# Altium schematic sheet [1] PWR.SchDoc: ESP32 KIT
size C; Organization: Altium Limited; Address1: L3, 12a Rodborough Rd; Address2: Frenchs Forest; Address3: NSW; Address4: Australia 2086; DocumentNumber: 1; Revision: 1.0; SheetNumber: 1; SheetTotal: 3
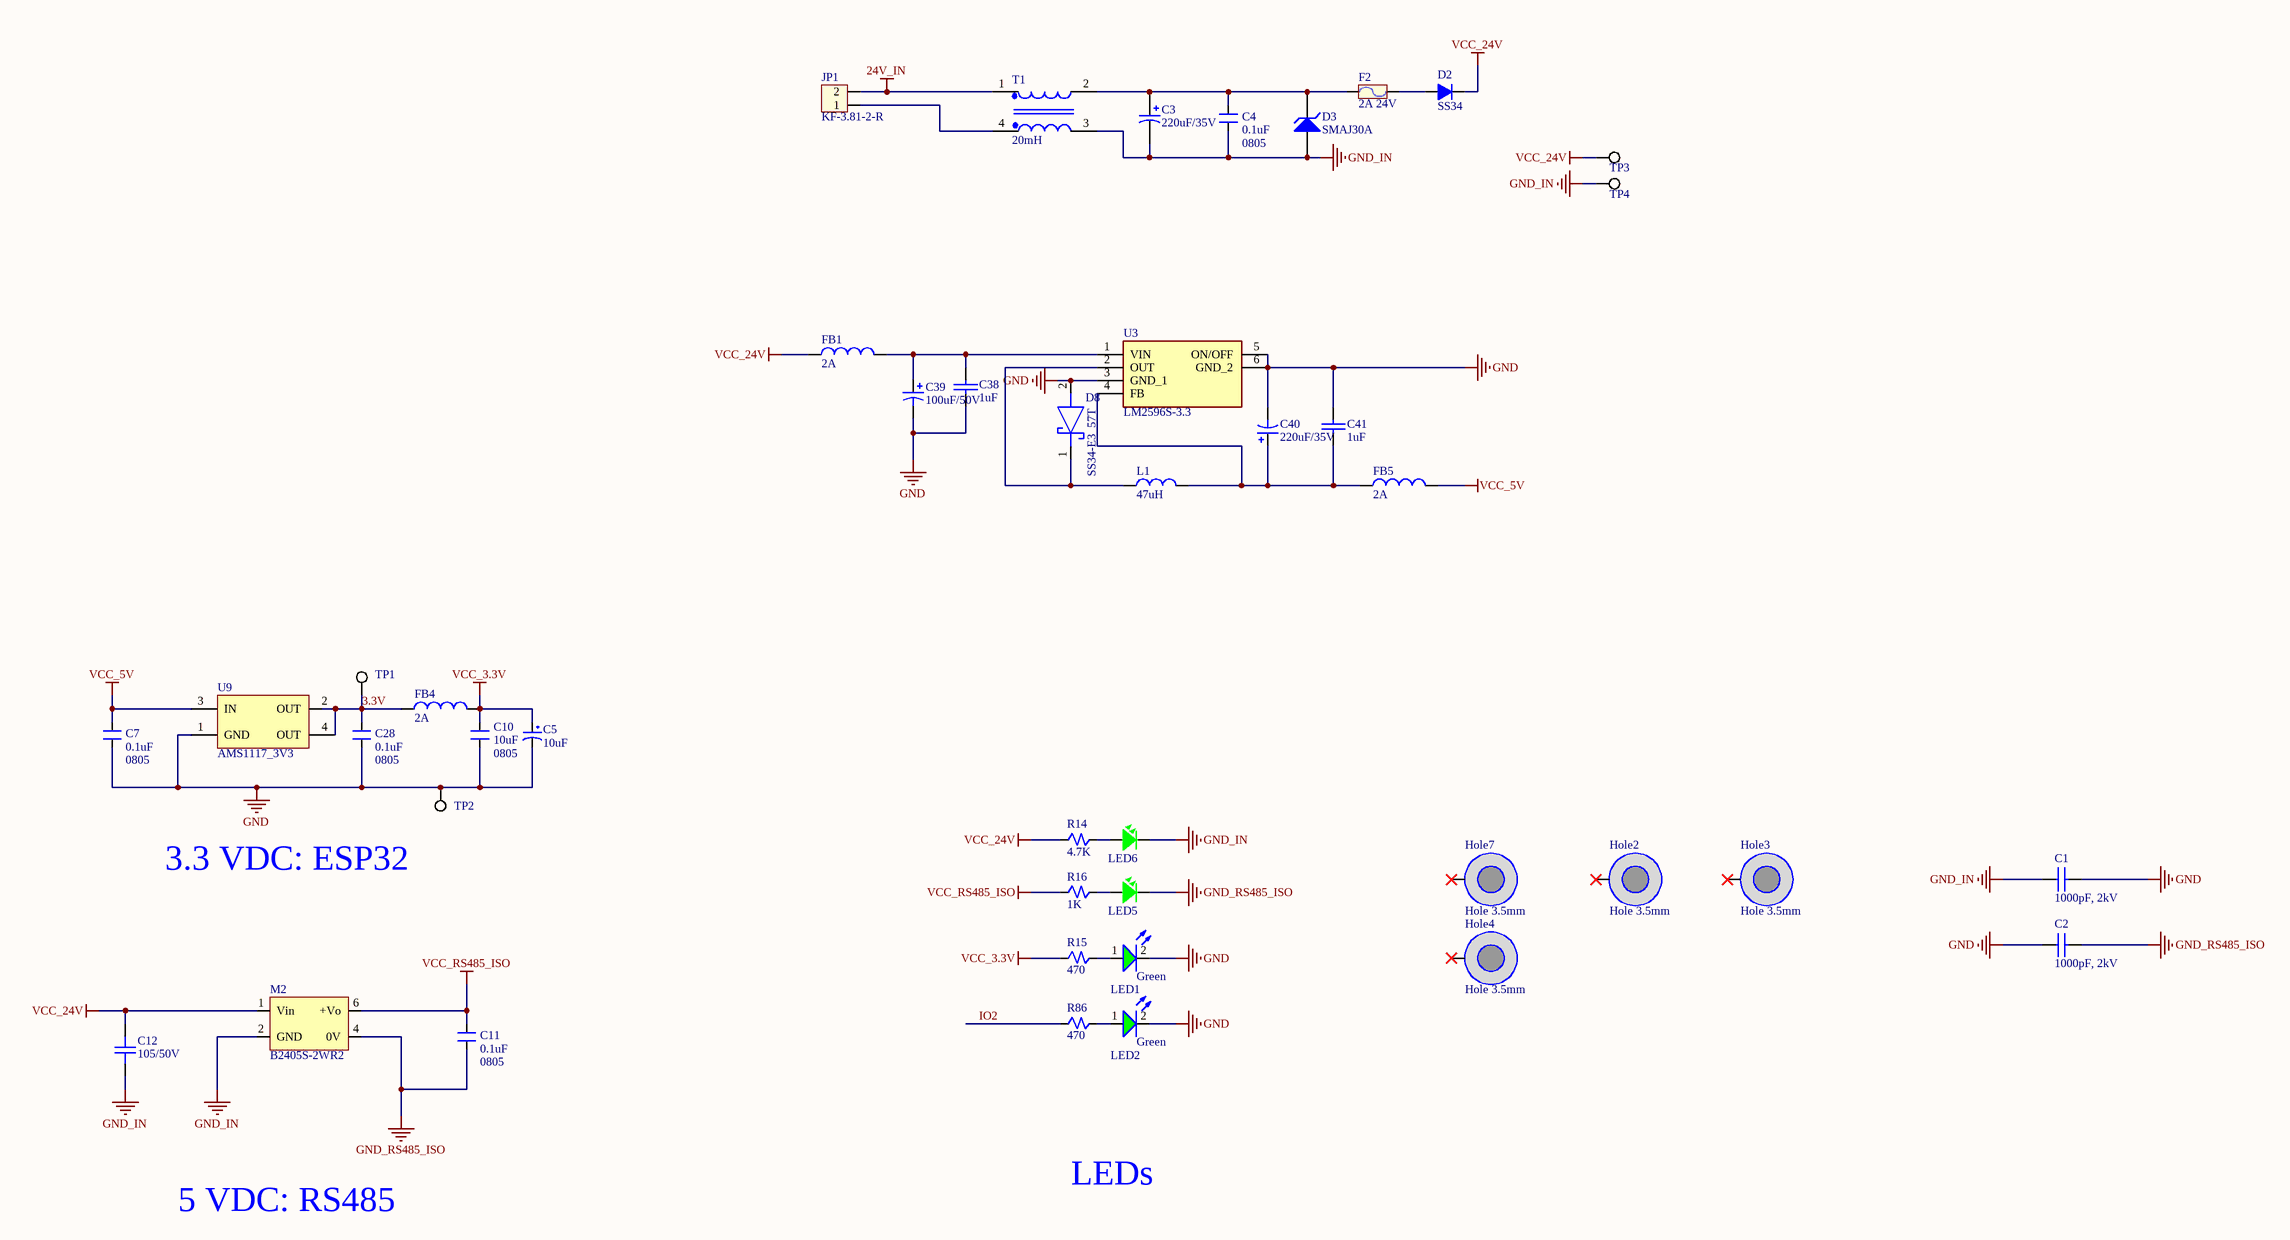
[diagram p0: [1] PWR.SchDoc]

## Parts
C1  1000pF, 2kV  [C1206]
C2  1000pF, 2kV  [C1206]
C3  220uF/35V  [CAP_ALUM_SMD_80102_TYPE_F]
C4  0.1uF  Package: 0805  [CN-SMD-0805]
C5  10uF  [tu tantalum smd3528]
C7  0.1uF  Package: 0805  [CN-SMD-0805]
C10  10uF  Package: 0805  [CN-SMD-0805]
C11  0.1uF  Package: 0805  [CN-SMD-0805]
C12  105/50V  [CAPC-1210 (3225)]
C28  0.1uF  Package: 0805  [CN-SMD-0805]
C38  1uF  [CN-SMD-0805]
C39  100uF/50V  [CAP SMD ALU SIZE F]
C40  220uF/35V  [CAP SMD ALU SIZE F]
C41  1uF  [CN-SMD-0805]
D2  SS34  [diot_smd]
D3  SMAJ30A  [DIODE_DO214AC_SMA]
D8  SS34-E3_57T  [diot_smd]
F2  2A 24V  [RES-SMD-1812]
FB1  2A  [INDC0805]
FB4  2A  [INDC0805]
FB5  2A  [INDC0805]
Hole2  Hole 3.5mm  [Screw Hole 3.5mm]
Hole3  Hole 3.5mm  [Screw Hole 3.5mm]
Hole4  Hole 3.5mm  [Screw Hole 3.5mm]
Hole7  Hole 3.5mm  [Screw Hole 3.5mm]
JP1  KF-3.81-2-R  [KF-3.81-2-R]
L1  47uH  [XL]
LED1  value Green  [LED5G]  (hidden comment: LED_G_5)
LED2  value Green  [LED5G]  (hidden comment: LED_G_5)
LED5  0805 Green  [LED-0805-Blue]  (value not drawn)
LED6  0805 Green  [LED-0805-Blue]  (value not drawn)
M2  B2405S-2WR2  [B_S-2WR2]
R14  4.7K  [RES_0805]
R15  470  [RES_0805]
R16  1K  [RES_0805]
R86  470  [RES_0805]
T1  20mH  [UU9.8-10mH]
TP1  TP 2x2mm  [TP 1.5x1.5mm]  (value not drawn)
TP2  TP 2x2mm  [TP 1.5x1.5mm]  (value not drawn)
TP3  TP 2x2mm  [TP 1.5x1.5mm]  (value not drawn)
TP4  TP 2x2mm  [TP 1.5x1.5mm]  (value not drawn)
U3  LM2596S-3.3  [TO-263]
U9  AMS1117_3V3  [SOT223-4M]

## Nets
24V_IN: JP1.2 T1.1(IN1)
GND: C1.2 C2.1 C5.2 C7.1 C10.1 C28.1 C38.2 C39.2 C40.2 C41.1 D8.2(A) LED1.2(K) LED2.2(K) TP2.3 U3.3(GND_1) U3.5(ON/OFF) U3.6(GND_2) U9.1(GND)
GND_IN: C1.1 C3.2 C4.1 C12.1 D3.1(A) LED6.2 M2.2(GND) T1.3(OUT2) TP4.3
GND_RS485_ISO: C2.2 C11.1 LED5.2 M2.4(0V)
VCC_3.3V: C5.1 C10.2 FB4.2 R15.1
VCC_5V: C7.2 FB5.2 U9.3(IN)
VCC_24V: C12.2 D2.2(K) FB1.1 M2.1(Vin) R14.1 TP3.3
VCC_RS485_ISO: C11.2 M2.6(+Vo) R16.1
3.3V: C28.2 FB4.1 TP1.3 U9.2(OUT) U9.4(OUT)
IO2: R86.1
NetC3_1: C3.1 C4.2 D3.2(K) F2.1 T1.2(IN2)
NetC38_1: C38.1 C39.1 FB1.2 U3.1(VIN)
NetC40_1: C40.1 C41.2 FB5.1 L1.2 U3.4(FB)
NetD2_1: D2.1(A) F2.2
NetD8_1: D8.1(K) L1.1 U3.2(OUT)
NetJP1_1: JP1.1 T1.4(OUT1)
NetLED1_1: LED1.1(A) R15.2
NetLED2_1: LED2.1(A) R86.2
NetLED5_1: LED5.1 R16.2
NetLED6_1: LED6.1 R14.2

Not connected (* = marked no-connect by the designer): Hole2 1(hole)*; Hole3 1(hole)*; Hole4 1(hole)*; Hole7 1(hole)*

## Notes on the sheet
- (near TP2) 3.3 VDC: ESP32
- 5 VDC: RS485
- LEDs
- Title
- Size:
- Date:
- File:
- C
- Number:
- Time:
- Revision:
- Sheet
- of

## Library data of the parts
C1 C2 = C1206X102KGRACTU: CAP CER 1000PF 2000V X7R 1206 FT; Manufacturer: Kemet; .Checked PCB: used; Voltage - Rated: 2000V (2kV); Tolerance: ±10%; Cross PN: C1206C102KGRACAUTO; Cross DES: CAP CER 1000PF 2KV X7R 1206; Capacitance: 1000pF; Category: Capacitors; Supplier Part Number: 399-5830-1-ND; Part Number: C1206X102KGRACTU; Operating Temperature: -55°C ~ 125°C; Package / Case: 1206 (3216 Metric); Price 1k [$]: 0.27600; Value: 1000pF, 2kV; .Checked SCH: used; Supplier: Digikey; Supplier 1: Digi-Key; Supplier Part Number 1: 399-5830-1-ND; RoHS: RoHS Compliant; Stock 1: 2068; Pricing 1: 1=0.92, 10=0.771, 25=0.6324, 100=0.483, 250=0.37952, 500=0.345, 1000=0.276 (USD); Temperature Coefficient: X7R; Mounting Type: Surface Mount, MLCC; Applications: Boardflex Sensitive; Ratings: -; Size / Dimension: 0.134" L x 0.063" W (3.40mm x 1.60mm); Height - Seated (Max): -; Thickness (Max): 0.069" (1.75mm); Lead Spacing: -; Features: Soft Termination, High Voltage; Packaging: Cut Tape (CT); Lead Style: -; ComponentLink1URL: http://www.kemet.com/kemet/web/homepage/kechome.nsf/weben/8311688D32A99EF8852578B500644843/$file/KEM_CC105_HIVOLT.pdf; ComponentLink1Description: http://www.kemet.com/kemet/web/homepage/kechome.nsf/weben/8311688D32A99EF8852578B500644843/$file/KEM_CC105_HIVOLT.pdf; Cross MNF: KEMET
C3 = EEE-FK1V221P: CAP ALUM 220uF 20% 35V SMD; Manufacturer: Panasonic; Solder: SMT; Cross PN: TGIC/25TLV220M8X10.5; Cross DES: Tụ Nhôm SMD 220uF 35V 8x10.5mm; Cross MNF: Thế Giới IC; Value: 220uF/35V; Category: CAPACITOR; PinCount: 2; Part Number: EEE-FK1V221P
C4 C7 C11 C28 = CAP 0.1uF 0805 10% 50V: CAP CER 0.1UF 50V 0805; Manufacturer: Minh Hà; Part Number: Tụ 0805 104-100nF 10% 50V; Tolerance: 10%; Dielectric: X5R; Voltage: 50V; ComponentLink1Description: Link VN; ComponentLink1URL: https://banlinhkien.com/tu-0805-104100nf-10-50v-10c-p6650428.html; Value: 0.1uF; Supplier: Minh Hà; Buy Link: https://banlinhkien.com/tu-0805-104100nf-10-50v-10c-p6650428.html
C5 = Tu tantalum 10uF 16V SMD3528: Dán; Don_Vi: Con; So_Chan: 2; Ten_Linh_Kien: Tụ tantalum 106C-10uF 16V SMD3528; Ma_Hang: MH007474; Chung_Loai: Dán; Kieu_Chan: *
C10 = CAP 10uF 0805 10% 16V: CAP CER 10UF 16V 0805; Manufacturer: Minh Hà; Part Number: Tụ 0805 106-10uF 10% 16V; Tolerance: 10%; Dielectric: X5R; ComponentLink1Description: Link VN; ComponentLink1URL: https://banlinhkien.com/tu-0805-10610uf-10-16v-10c-p6650430.html; Value: 10uF
C12 = CC1210KKX7R9BB105: CAP CER 1UF 50V X7R 1210; Manufacturer: Yageo; Solder: SMT; Value: 105/50V; Category: CAPACITOR; PinCount: 2; Part Number: CC1210KKX7R9BB105
C38 C41 = CAP: Capacitor
C39 = 100uF/50V/RADIAL 8X11.5/20%: CAP ALUM 100UF 20% 50V RADIAL; Manufacturer: Panasonic Electronic Components; Manufacturer Part Number: ECA-1HM101B; Capacitance: 100µF; Lifetime @ Temp.: 2000 Hrs @ 85°C; Ripple Current: 250mA; Supplier 1: Digi-Key; RoHS: RoHS Compliant; Category: Capacitors; Stock 1: 24000; Pricing 1: 1000=0.08607, 2000=0.08154, 5000=0.07701, 10000=0.07248, 25000=0.06795, 50000=0.06342, 100000=0.05889 (USD); Packaging: Tape & Box (TB); Tolerance: ±20%; Voltage Rating: 50V; ESR (Equivalent Series Resistance): -; Operating Temperature: -40°C ~ 85°C; Type: -; Applications: General Purpose; Impedance: -; Lead Spacing: 0.197" (5.00mm); Size / Dimension: 0.315" Dia (8.00mm); Height - Seated (Max): 0.492" (12.50mm); Surface Mount Land Size: -; Mounting Type: Through Hole; Package / Case: Radial, Can; ComponentLink1URL: http://industrial.panasonic.com/www-cgi/jvcr13pz.cgi?E+PZ+3+ABA0012+ECA1HM101B+7+WW; ComponentLink1Description: http://industrial.panasonic.com/www-cgi/jvcr13pz.cgi?E+PZ+3+ABA0012+ECA1HM101B+7+WW
C40 = 270uF/35V/RADIAL 8X11.5/20%: CAP ALUM 270UF 20% 35V RADIAL; Manufacturer: Panasonic Electronic Components; Manufacturer Part Number: EEU-FR1V271LB; Capacitance: 270µF; Lifetime @ Temp.: 8000 Hrs @ 105°C; Ripple Current: 1.24A; Impedance: 41 mOhm; Supplier 1: Digi-Key; RoHS: RoHS Compliant; Category: Capacitors; Stock 1: 2000; Pricing 1: 1000=0.17765, 2000=0.1672, 5000=0.15675, 10000=0.1463, 25000=0.14108, 50000=0.13585, 100000=0.13063 (USD); Packaging: Tape & Box (TB); Tolerance: ±20%; Voltage Rating: 35V; ESR (Equivalent Series Resistance): -; Operating Temperature: -40°C ~ 105°C; Type: -; Applications: General Purpose; Lead Spacing: 0.197" (5.00mm); Size / Dimension: 0.315" Dia (8.00mm); Height - Seated (Max): 0.650" (16.50mm); Surface Mount Land Size: -; Mounting Type: Through Hole; Package / Case: Radial, Can; ComponentLink1URL: http://media.digikey.com/pdf/Data%20Sheets/Panasonic%20Electronic%20Components/EEU-FR_Series.pdf; ComponentLink1Description: http://media.digikey.com/pdf/Data%20Sheets/Panasonic%20Electronic%20Components/EEU-FR_Series.pdf; Supplier Part Number 1: P15388TB-ND
D2 = SS34_SMA: DIODE SMD S3M 1N5822 3A 40V SMA; Manufacturer: Minh Hà; Value: 40V/3A; Part Number: SS34; Current: 3A; Voltage: 40V; Package: SMA; ComponentLink1Description: Link VN; ComponentLink1URL: https://banlinhkien.com/diode-ss34-3a-40v-sma-1n5822-ss34a-p6652165.html
D3 = SMAJ30A: TVS DIODE 30V 48.4V DO214AC; Manufacturer: Littelfuse Inc; Solder: SMT; Value: SMAJ30A; Part Number: SMAJ30A
D8 = SS34-E3_57T: Schottky Diode; Manufacturer_Name: Vishay; Manufacturer_Part_Number: SS34-E3/57T; Datasheet Link: https://www.vishay.com/docs/88751/ss32.pdf; Height: 2.62mm; Arrow Part Number: SS34-E3/57T; Arrow Price/Stock: https://www.arrow.com/en/products/ss34-e357t/vishay; Mouser Part Number: 625-SS34-E3; Mouser Price/Stock: https://www.mouser.co.uk/ProductDetail/Vishay-General-Semiconductor/SS34-E3-57T?qs=x2jpVgRnAtMC3f38kYWnRw%3D%3D
F2 = FUSE 2A 24V: Cầu Chì Tự Phục Hồi 2A 24V SMD1812; Manufacturer: Minh Hà; Part Number: MH010033
FB1 FB4 FB5 = FERRITE BEAD_CBW201209U121T: FERRITE BEAD 100 mOhm DCR 2A 120 OHM 0805; Manufacturer: Fenghua Electronics; Part Number: CBW201209U121T; Supplier: Thế Giới IC; Buy Link: https://www.thegioiic.com/products/cbw201209u121t-ferrite-bead-2a-120-ohm-0805
Hole2-Hole4 Hole7 = Hole 3.5mm: VIT Hole 3.5mm; Part Number: VIT 3.5mm; Manufacturer: Temas
JP1 = Con_2C: Terminal Block Plug-in Hàn PCB Chân Cong 3.81mm; Value: Connector 3; BuyLink: https://www.thegioiic.com/products/kf142-5-08-3-r-terminal-block-3-tiep-diem-cam-day-ngang-5-08mm; ComponentLink1Description: Buy link; ComponentLink1URL: https://www.thegioiic.com/products/kf-3-81-3-r-terminal-block-plug-in-han-pcb-3-chan-cong-3-81mm
L1 = Inductor: Value: 150 mH
LED1 LED2 = LED_GREEN_5MM: LED Green 5mm; ComponentLink1Description: Datasheet; ComponentLink1URL: D:\Dropbox\Datasheets\Opto and Illumination\LEDs\SMD LED.pdf; Unit Price: 0.0476
LED5 LED6 = LED 0805 Màu Xanh Lá (Green): Manufacturer: Minh Hà; Value: Green; Part Number: LED 0805 Màu Xanh Lá (Green); ComponentLink1Description: Link VN; ComponentLink1URL: https://banlinhkien.com/led-0805-mau-xanh-la-green5c-p19524188.html
M2 = B2405S-2WR2: MODULE 24-05V 0.4A Isolated 2W; Manufacturer: Mornsun; Part Number: B2405S-2WR2; ComponentLink1Description: Link VN; ComponentLink1URL: https://www.thegioiic.com/products/b2405s-2wr2-chuyen-doi-dc-dc-vao-24v-ra-5v-2w
R14 = RES 4.7K 0805 1% 1/8W: Điện Trở 4.7 KOhm 0805 1% 1/8W /; Part Number: Trở 0805 1% 4.7K; Manufacturer: Minh Hà; ComponentLink1Description: Link VN; ComponentLink1URL: https://banlinhkien.com/tro-0805-1-4.7k-50c-p12913923.html; Package: 0805; Tolerance: 1%; Power: 1/8W
R15 R86 = RES 470R 0805 1% 1/8W: Điện Trở 470 Ohm 0805 1% 1/8W /; Part Number: Trở 0805 1% 470R; Manufacturer: Minh Hà; ComponentLink1Description: Link VN; ComponentLink1URL: https://banlinhkien.com/tro-0805-1-470r-50c-p17823145.html; Package: 0805; Tolerance: 1%; Power: 1/8W
R16 = RES 1K 0805 1% 1/8W: Điện Trở 1 KOhm 0805 1% 1/8W /; Part Number: Trở 0805 1% 1K; Manufacturer: Minh Hà; ComponentLink1Description: Link VN; ComponentLink1URL: https://banlinhkien.com/tro-0805-1-1k-50c-p6651948.html; Package: 0805; Tolerance: 1%; Power: 1/8W
T1 = UU9.8-203: Power Transformers 20mH; Manufacturer: OEM; ComponentLink1Description: New link; ComponentLink1URL: *; Part Number: UU9.8-203
TP1-TP4 = TP 2x2mm: Test Point 2x2mm; Manufacturer: TEMAS; Part Number: TEST POINT 2x2MM
U3 = LM2596S-3.3: Integrated Circuit; Manufacturer_Name: Texas Instruments; Datasheet Link: http://www.ti.com/lit/ds/symlink/lm2596.pdf; Height: 4.65mm; Manufacturer_Part_Number: LM2596S-3.3; Arrow Part Number: LM2596S-3.3; Arrow Price/Stock: https://www.arrow.com/en/products/lm2596s-3.3/texas-instruments; Mouser Part Number: 926-LM2596S-33; Mouser Price/Stock: https://www.mouser.co.uk/ProductDetail/Texas-Instruments/LM2596S-33?qs=X1J7HmVL2ZHnG50G34wg0g%3D%3D
U9 = AMS1117_3V3: 1A Regulator